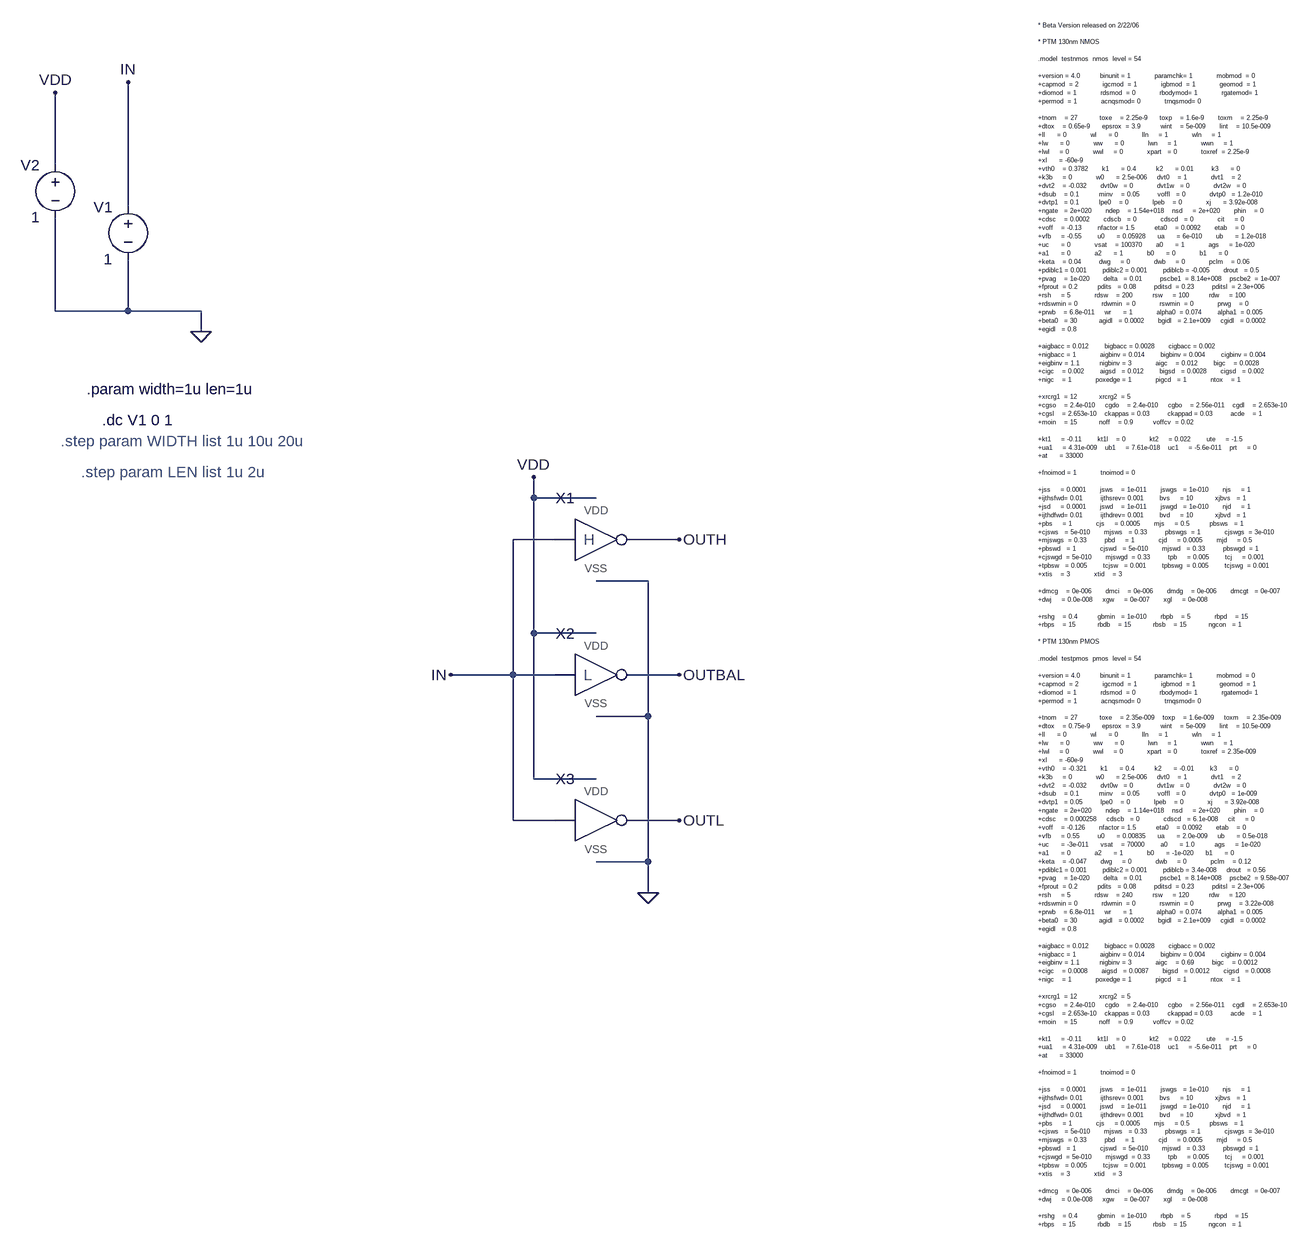
[diagram p0: schematic skewed_inverters.asc]
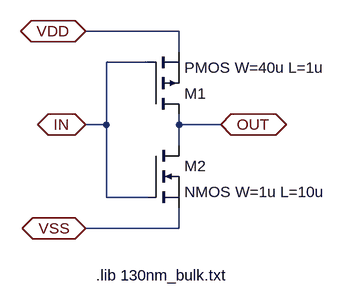
[diagram p1: sub-circuit skewh_inverter.asc]
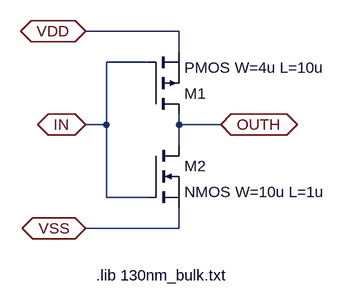
[diagram p2: sub-circuit skewl_inverter.asc]
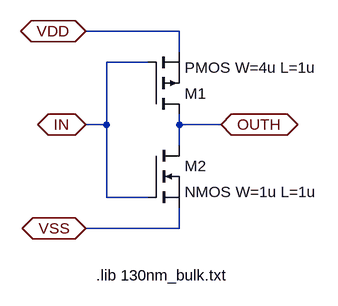
[diagram p3: sub-circuit skewm_inverter.asc]
skewed_inverters.asc, the LTspice schematic file:
Version 4
SHEET 1 1832 3340
WIRE -704 96 -704 -16
WIRE -592 160 -592 -32
WIRE -704 320 -704 176
WIRE -592 320 -592 240
WIRE -592 320 -704 320
WIRE -480 320 -592 320
WIRE -480 352 -480 320
WIRE 32 608 32 576
WIRE 128 608 32 608
WIRE 64 672 0 672
WIRE 256 672 176 672
WIRE 208 736 128 736
WIRE 32 816 32 608
WIRE 128 816 32 816
WIRE 0 880 0 672
WIRE 0 880 -96 880
WIRE 64 880 0 880
WIRE 256 880 176 880
WIRE 208 944 208 736
WIRE 208 944 128 944
WIRE 32 1040 32 816
WIRE 128 1040 32 1040
WIRE 0 1104 0 880
WIRE 64 1104 0 1104
WIRE 256 1104 176 1104
WIRE 208 1168 208 944
WIRE 208 1168 128 1168
WIRE 208 1216 208 1168
FLAG -480 352 0
FLAG -592 -32 IN
FLAG 256 672 OUTH
FLAG -704 -16 VDD
FLAG -96 880 IN
FLAG 256 880 OUTBAL
FLAG 256 1104 OUTL
FLAG 208 1216 0
FLAG 32 576 VDD
SYMBOL voltage -592 144 M0
WINDOW 123 0 0 Left 0
WINDOW 39 0 0 Left 0
SYMATTR InstName V1
SYMATTR Value 1
SYMBOL voltage -704 80 M0
WINDOW 123 0 0 Left 0
WINDOW 39 0 0 Left 0
SYMATTR InstName V2
SYMATTR Value 1
SYMBOL skewH_inverter 128 656 R0
SYMATTR InstName X1
SYMBOL skewL_inverter 128 864 R0
SYMATTR InstName X2
SYMBOL skewM_inverter 128 1088 R0
SYMATTR InstName X3
TEXT 808 -120 Left 0 !* Beta Version released on 2/22/06\n \n* PTM 130nm NMOS \n \n.model  testnmos  nmos  level = 54\n \n+version = 4.0          binunit = 1            paramchk= 1            mobmod  = 0          \n+capmod  = 2            igcmod  = 1            igbmod  = 1            geomod  = 1          \n+diomod  = 1            rdsmod  = 0            rbodymod= 1            rgatemod= 1          \n+permod  = 1            acnqsmod= 0            trnqsmod= 0          \n \n+tnom    = 27           toxe    = 2.25e-9      toxp    = 1.6e-9       toxm    = 2.25e-9   \n+dtox    = 0.65e-9      epsrox  = 3.9          wint    = 5e-009       lint    = 10.5e-009   \n+ll      = 0            wl      = 0            lln     = 1            wln     = 1          \n+lw      = 0            ww      = 0            lwn     = 1            wwn     = 1          \n+lwl     = 0            wwl     = 0            xpart   = 0            toxref  = 2.25e-9   \n+xl      = -60e-9\n+vth0    = 0.3782       k1      = 0.4          k2      = 0.01         k3      = 0          \n+k3b     = 0            w0      = 2.5e-006     dvt0    = 1            dvt1    = 2       \n+dvt2    = -0.032       dvt0w   = 0            dvt1w   = 0            dvt2w   = 0          \n+dsub    = 0.1          minv    = 0.05         voffl   = 0            dvtp0   = 1.2e-010     \n+dvtp1   = 0.1          lpe0    = 0            lpeb    = 0            xj      = 3.92e-008   \n+ngate   = 2e+020       ndep    = 1.54e+018    nsd     = 2e+020       phin    = 0          \n+cdsc    = 0.0002       cdscb   = 0            cdscd   = 0            cit     = 0          \n+voff    = -0.13        nfactor = 1.5          eta0    = 0.0092       etab    = 0          \n+vfb     = -0.55        u0      = 0.05928      ua      = 6e-010       ub      = 1.2e-018     \n+uc      = 0            vsat    = 100370       a0      = 1            ags     = 1e-020     \n+a1      = 0            a2      = 1            b0      = 0            b1      = 0          \n+keta    = 0.04         dwg     = 0            dwb     = 0            pclm    = 0.06       \n+pdiblc1 = 0.001        pdiblc2 = 0.001        pdiblcb = -0.005       drout   = 0.5        \n+pvag    = 1e-020       delta   = 0.01         pscbe1  = 8.14e+008    pscbe2  = 1e-007     \n+fprout  = 0.2          pdits   = 0.08         pditsd  = 0.23         pditsl  = 2.3e+006   \n+rsh     = 5            rdsw    = 200          rsw     = 100          rdw     = 100        \n+rdswmin = 0            rdwmin  = 0            rswmin  = 0            prwg    = 0          \n+prwb    = 6.8e-011     wr      = 1            alpha0  = 0.074        alpha1  = 0.005      \n+beta0   = 30           agidl   = 0.0002       bgidl   = 2.1e+009     cgidl   = 0.0002     \n+egidl   = 0.8          \n \n+aigbacc = 0.012        bigbacc = 0.0028       cigbacc = 0.002     \n+nigbacc = 1            aigbinv = 0.014        bigbinv = 0.004        cigbinv = 0.004      \n+eigbinv = 1.1          nigbinv = 3            aigc    = 0.012        bigc    = 0.0028     \n+cigc    = 0.002        aigsd   = 0.012        bigsd   = 0.0028       cigsd   = 0.002     \n+nigc    = 1            poxedge = 1            pigcd   = 1            ntox    = 1          \n \n+xrcrg1  = 12           xrcrg2  = 5          \n+cgso    = 2.4e-010     cgdo    = 2.4e-010     cgbo    = 2.56e-011    cgdl    = 2.653e-10     \n+cgsl    = 2.653e-10    ckappas = 0.03         ckappad = 0.03         acde    = 1          \n+moin    = 15           noff    = 0.9          voffcv  = 0.02       \n \n+kt1     = -0.11        kt1l    = 0            kt2     = 0.022        ute     = -1.5       \n+ua1     = 4.31e-009    ub1     = 7.61e-018    uc1     = -5.6e-011    prt     = 0          \n+at      = 33000      \n \n+fnoimod = 1            tnoimod = 0          \n \n+jss     = 0.0001       jsws    = 1e-011       jswgs   = 1e-010       njs     = 1          \n+ijthsfwd= 0.01         ijthsrev= 0.001        bvs     = 10           xjbvs   = 1          \n+jsd     = 0.0001       jswd    = 1e-011       jswgd   = 1e-010       njd     = 1          \n+ijthdfwd= 0.01         ijthdrev= 0.001        bvd     = 10           xjbvd   = 1          \n+pbs     = 1            cjs     = 0.0005       mjs     = 0.5          pbsws   = 1          \n+cjsws   = 5e-010       mjsws   = 0.33         pbswgs  = 1            cjswgs  = 3e-010     \n+mjswgs  = 0.33         pbd     = 1            cjd     = 0.0005       mjd     = 0.5        \n+pbswd   = 1            cjswd   = 5e-010       mjswd   = 0.33         pbswgd  = 1          \n+cjswgd  = 5e-010       mjswgd  = 0.33         tpb     = 0.005        tcj     = 0.001      \n+tpbsw   = 0.005        tcjsw   = 0.001        tpbswg  = 0.005        tcjswg  = 0.001      \n+xtis    = 3            xtid    = 3          \n \n+dmcg    = 0e-006       dmci    = 0e-006       dmdg    = 0e-006       dmcgt   = 0e-007     \n+dwj     = 0.0e-008     xgw     = 0e-007       xgl     = 0e-008     \n \n+rshg    = 0.4          gbmin   = 1e-010       rbpb    = 5            rbpd    = 15         \n+rbps    = 15           rbdb    = 15           rbsb    = 15           ngcon   = 1          \n \n* PTM 130nm PMOS\n \n.model  testpmos  pmos  level = 54\n \n+version = 4.0          binunit = 1            paramchk= 1            mobmod  = 0          \n+capmod  = 2            igcmod  = 1            igbmod  = 1            geomod  = 1          \n+diomod  = 1            rdsmod  = 0            rbodymod= 1            rgatemod= 1          \n+permod  = 1            acnqsmod= 0            trnqsmod= 0          \n \n+tnom    = 27           toxe    = 2.35e-009    toxp    = 1.6e-009     toxm    = 2.35e-009   \n+dtox    = 0.75e-9      epsrox  = 3.9          wint    = 5e-009       lint    = 10.5e-009   \n+ll      = 0            wl      = 0            lln     = 1            wln     = 1          \n+lw      = 0            ww      = 0            lwn     = 1            wwn     = 1          \n+lwl     = 0            wwl     = 0            xpart   = 0            toxref  = 2.35e-009   \n+xl      = -60e-9\n+vth0    = -0.321       k1      = 0.4          k2      = -0.01        k3      = 0          \n+k3b     = 0            w0      = 2.5e-006     dvt0    = 1            dvt1    = 2       \n+dvt2    = -0.032       dvt0w   = 0            dvt1w   = 0            dvt2w   = 0          \n+dsub    = 0.1          minv    = 0.05         voffl   = 0            dvtp0   = 1e-009     \n+dvtp1   = 0.05         lpe0    = 0            lpeb    = 0            xj      = 3.92e-008   \n+ngate   = 2e+020       ndep    = 1.14e+018    nsd     = 2e+020       phin    = 0          \n+cdsc    = 0.000258     cdscb   = 0            cdscd   = 6.1e-008     cit     = 0          \n+voff    = -0.126       nfactor = 1.5          eta0    = 0.0092       etab    = 0          \n+vfb     = 0.55         u0      = 0.00835      ua      = 2.0e-009     ub      = 0.5e-018     \n+uc      = -3e-011      vsat    = 70000        a0      = 1.0          ags     = 1e-020     \n+a1      = 0            a2      = 1            b0      = -1e-020      b1      = 0          \n+keta    = -0.047       dwg     = 0            dwb     = 0            pclm    = 0.12       \n+pdiblc1 = 0.001        pdiblc2 = 0.001        pdiblcb = 3.4e-008     drout   = 0.56       \n+pvag    = 1e-020       delta   = 0.01         pscbe1  = 8.14e+008    pscbe2  = 9.58e-007  \n+fprout  = 0.2          pdits   = 0.08         pditsd  = 0.23         pditsl  = 2.3e+006   \n+rsh     = 5            rdsw    = 240          rsw     = 120          rdw     = 120        \n+rdswmin = 0            rdwmin  = 0            rswmin  = 0            prwg    = 3.22e-008  \n+prwb    = 6.8e-011     wr      = 1            alpha0  = 0.074        alpha1  = 0.005      \n+beta0   = 30           agidl   = 0.0002       bgidl   = 2.1e+009     cgidl   = 0.0002     \n+egidl   = 0.8          \n \n+aigbacc = 0.012        bigbacc = 0.0028       cigbacc = 0.002     \n+nigbacc = 1            aigbinv = 0.014        bigbinv = 0.004        cigbinv = 0.004      \n+eigbinv = 1.1          nigbinv = 3            aigc    = 0.69         bigc    = 0.0012     \n+cigc    = 0.0008       aigsd   = 0.0087       bigsd   = 0.0012       cigsd   = 0.0008     \n+nigc    = 1            poxedge = 1            pigcd   = 1            ntox    = 1 \n         \n+xrcrg1  = 12           xrcrg2  = 5          \n+cgso    = 2.4e-010     cgdo    = 2.4e-010     cgbo    = 2.56e-011    cgdl    = 2.653e-10\n+cgsl    = 2.653e-10    ckappas = 0.03         ckappad = 0.03         acde    = 1\n+moin    = 15           noff    = 0.9          voffcv  = 0.02\n \n+kt1     = -0.11        kt1l    = 0            kt2     = 0.022        ute     = -1.5       \n+ua1     = 4.31e-009    ub1     = 7.61e-018    uc1     = -5.6e-011    prt     = 0          \n+at      = 33000      \n \n+fnoimod = 1            tnoimod = 0          \n \n+jss     = 0.0001       jsws    = 1e-011       jswgs   = 1e-010       njs     = 1          \n+ijthsfwd= 0.01         ijthsrev= 0.001        bvs     = 10           xjbvs   = 1          \n+jsd     = 0.0001       jswd    = 1e-011       jswgd   = 1e-010       njd     = 1          \n+ijthdfwd= 0.01         ijthdrev= 0.001        bvd     = 10           xjbvd   = 1          \n+pbs     = 1            cjs     = 0.0005       mjs     = 0.5          pbsws   = 1          \n+cjsws   = 5e-010       mjsws   = 0.33         pbswgs  = 1            cjswgs  = 3e-010     \n+mjswgs  = 0.33         pbd     = 1            cjd     = 0.0005       mjd     = 0.5        \n+pbswd   = 1            cjswd   = 5e-010       mjswd   = 0.33         pbswgd  = 1          \n+cjswgd  = 5e-010       mjswgd  = 0.33         tpb     = 0.005        tcj     = 0.001      \n+tpbsw   = 0.005        tcjsw   = 0.001        tpbswg  = 0.005        tcjswg  = 0.001      \n+xtis    = 3            xtid    = 3          \n \n+dmcg    = 0e-006       dmci    = 0e-006       dmdg    = 0e-006       dmcgt   = 0e-007     \n+dwj     = 0.0e-008     xgw     = 0e-007       xgl     = 0e-008     \n \n+rshg    = 0.4          gbmin   = 1e-010       rbpb    = 5            rbpd    = 15         \n+rbps    = 15           rbdb    = 15           rbsb    = 15           ngcon   = 1
TEXT -632 488 Left 2 !.dc V1 0 1
TEXT -656 440 Left 2 !.param width=1u len=1u
TEXT -696 520 Left 2 ;.step param WIDTH list 1u 10u 20u
TEXT -664 568 Left 2 ;.step param LEN list 1u 2u

skewh_inverter.asc, the sub-circuit schematic file:
Version 4
SHEET 1 880 680
WIRE 128 -48 -16 -48
WIRE 128 -16 128 -48
WIRE 80 0 16 0
WIRE 16 96 16 0
WIRE 16 96 -16 96
WIRE 128 96 128 80
WIRE 192 96 128 96
WIRE 128 128 128 96
WIRE 16 208 16 96
WIRE 80 208 16 208
WIRE 128 256 128 224
WIRE 128 256 -16 256
FLAG 192 96 OUT
IOPIN 192 96 BiDir
FLAG -16 -48 VDD
IOPIN -16 -48 BiDir
FLAG -16 96 IN
IOPIN -16 96 BiDir
FLAG -16 256 VSS
IOPIN -16 256 BiDir
SYMBOL pmos 80 80 M180
SYMATTR InstName M1
SYMATTR Value PMOS W=40u L=1u
SYMBOL nmos 80 128 R0
SYMATTR InstName M2
SYMATTR Value NMOS W=1u L=10u
TEXT 0 328 Left 2 !.lib 130nm_bulk.txt

skewl_inverter.asc, the sub-circuit schematic file:
Version 4
SHEET 1 880 980
WIRE 320 -128 176 -128
WIRE 320 -96 320 -128
WIRE 272 -80 208 -80
WIRE 208 16 208 -80
WIRE 208 16 176 16
WIRE 320 16 320 0
WIRE 384 16 320 16
WIRE 320 48 320 16
WIRE 208 128 208 16
WIRE 272 128 208 128
WIRE 320 176 320 144
WIRE 320 176 176 176
FLAG 384 16 OUTH
IOPIN 384 16 BiDir
FLAG 176 -128 VDD
IOPIN 176 -128 BiDir
FLAG 176 16 IN
IOPIN 176 16 BiDir
FLAG 176 176 VSS
IOPIN 176 176 BiDir
SYMBOL pmos 272 0 M180
SYMATTR InstName M1
SYMATTR Value PMOS W=4u L=10u
SYMBOL nmos 272 48 R0
SYMATTR InstName M2
SYMATTR Value NMOS W=10u L=1u
TEXT 192 248 Left 2 !.lib 130nm_bulk.txt

skewm_inverter.asc, the sub-circuit schematic file:
Version 4
SHEET 1 880 980
WIRE 320 -128 176 -128
WIRE 320 -96 320 -128
WIRE 272 -80 208 -80
WIRE 208 16 208 -80
WIRE 208 16 176 16
WIRE 320 16 320 0
WIRE 384 16 320 16
WIRE 320 48 320 16
WIRE 208 128 208 16
WIRE 272 128 208 128
WIRE 320 176 320 144
WIRE 320 176 176 176
FLAG 384 16 OUTH
IOPIN 384 16 BiDir
FLAG 176 -128 VDD
IOPIN 176 -128 BiDir
FLAG 176 16 IN
IOPIN 176 16 BiDir
FLAG 176 176 VSS
IOPIN 176 176 BiDir
SYMBOL pmos 272 0 M180
SYMATTR InstName M1
SYMATTR Value PMOS W=4u L=1u
SYMBOL nmos 272 48 R0
SYMATTR InstName M2
SYMATTR Value NMOS W=1u L=1u
TEXT 192 248 Left 2 !.lib 130nm_bulk.txt

The netlist it stands for:
* skewed_inverters.asc
V1 IN 0 1
V2 VDD 0 1
XX1 IN OUTH VDD 0 skewh_inverter
XX2 IN OUTBAL VDD 0 skewl_inverter
XX3 IN OUTL VDD 0 skewm_inverter

* block symbol definitions
.subckt skewh_inverter IN OUT VDD VSS
M1 OUT IN VDD VDD PMOS W=40u L=1u
M2 OUT IN VSS VSS NMOS W=1u L=10u
.lib 130nm_bulk.txt
.ends skewh_inverter

.subckt skewl_inverter IN OUTH VDD VSS
M1 OUTH IN VDD VDD PMOS W=4u L=10u
M2 OUTH IN VSS VSS NMOS W=10u L=1u
.lib 130nm_bulk.txt
.ends skewl_inverter

.subckt skewm_inverter IN OUTH VDD VSS
M1 OUTH IN VDD VDD PMOS W=4u L=1u
M2 OUTH IN VSS VSS NMOS W=1u L=1u
.lib 130nm_bulk.txt
.ends skewm_inverter

.model NMOS NMOS
.model PMOS PMOS
.lib standard.mos
* Beta Version released on 2/22/06
* PTM 130nm NMOS
.model  testnmos  nmos  level = 54
+version = 4.0          binunit = 1            paramchk= 1            mobmod  = 0
+capmod  = 2            igcmod  = 1            igbmod  = 1            geomod  = 1
+diomod  = 1            rdsmod  = 0            rbodymod= 1            rgatemod= 1
+permod  = 1            acnqsmod= 0            trnqsmod= 0
+tnom    = 27           toxe    = 2.25e-9      toxp    = 1.6e-9       toxm    = 2.25e-9
+dtox    = 0.65e-9      epsrox  = 3.9          wint    = 5e-009       lint    = 10.5e-009
+ll      = 0            wl      = 0            lln     = 1            wln     = 1
+lw      = 0            ww      = 0            lwn     = 1            wwn     = 1
+lwl     = 0            wwl     = 0            xpart   = 0            toxref  = 2.25e-9
+xl      = -60e-9
+vth0    = 0.3782       k1      = 0.4          k2      = 0.01         k3      = 0
+k3b     = 0            w0      = 2.5e-006     dvt0    = 1            dvt1    = 2
+dvt2    = -0.032       dvt0w   = 0            dvt1w   = 0            dvt2w   = 0
+dsub    = 0.1          minv    = 0.05         voffl   = 0            dvtp0   = 1.2e-010
+dvtp1   = 0.1          lpe0    = 0            lpeb    = 0            xj      = 3.92e-008
+ngate   = 2e+020       ndep    = 1.54e+018    nsd     = 2e+020       phin    = 0
+cdsc    = 0.0002       cdscb   = 0            cdscd   = 0            cit     = 0
+voff    = -0.13        nfactor = 1.5          eta0    = 0.0092       etab    = 0
+vfb     = -0.55        u0      = 0.05928      ua      = 6e-010       ub      = 1.2e-018
+uc      = 0            vsat    = 100370       a0      = 1            ags     = 1e-020
+a1      = 0            a2      = 1            b0      = 0            b1      = 0
+keta    = 0.04         dwg     = 0            dwb     = 0            pclm    = 0.06
+pdiblc1 = 0.001        pdiblc2 = 0.001        pdiblcb = -0.005       drout   = 0.5
+pvag    = 1e-020       delta   = 0.01         pscbe1  = 8.14e+008    pscbe2  = 1e-007
+fprout  = 0.2          pdits   = 0.08         pditsd  = 0.23         pditsl  = 2.3e+006
+rsh     = 5            rdsw    = 200          rsw     = 100          rdw     = 100
+rdswmin = 0            rdwmin  = 0            rswmin  = 0            prwg    = 0
+prwb    = 6.8e-011     wr      = 1            alpha0  = 0.074        alpha1  = 0.005
+beta0   = 30           agidl   = 0.0002       bgidl   = 2.1e+009     cgidl   = 0.0002
+egidl   = 0.8
+aigbacc = 0.012        bigbacc = 0.0028       cigbacc = 0.002
+nigbacc = 1            aigbinv = 0.014        bigbinv = 0.004        cigbinv = 0.004
+eigbinv = 1.1          nigbinv = 3            aigc    = 0.012        bigc    = 0.0028
+cigc    = 0.002        aigsd   = 0.012        bigsd   = 0.0028       cigsd   = 0.002
+nigc    = 1            poxedge = 1            pigcd   = 1            ntox    = 1
+xrcrg1  = 12           xrcrg2  = 5
+cgso    = 2.4e-010     cgdo    = 2.4e-010     cgbo    = 2.56e-011    cgdl    = 2.653e-10
+cgsl    = 2.653e-10    ckappas = 0.03         ckappad = 0.03         acde    = 1
+moin    = 15           noff    = 0.9          voffcv  = 0.02
+kt1     = -0.11        kt1l    = 0            kt2     = 0.022        ute     = -1.5
+ua1     = 4.31e-009    ub1     = 7.61e-018    uc1     = -5.6e-011    prt     = 0
+at      = 33000
+fnoimod = 1            tnoimod = 0
+jss     = 0.0001       jsws    = 1e-011       jswgs   = 1e-010       njs     = 1
+ijthsfwd= 0.01         ijthsrev= 0.001        bvs     = 10           xjbvs   = 1
+jsd     = 0.0001       jswd    = 1e-011       jswgd   = 1e-010       njd     = 1
+ijthdfwd= 0.01         ijthdrev= 0.001        bvd     = 10           xjbvd   = 1
+pbs     = 1            cjs     = 0.0005       mjs     = 0.5          pbsws   = 1
+cjsws   = 5e-010       mjsws   = 0.33         pbswgs  = 1            cjswgs  = 3e-010
+mjswgs  = 0.33         pbd     = 1            cjd     = 0.0005       mjd     = 0.5
+pbswd   = 1            cjswd   = 5e-010       mjswd   = 0.33         pbswgd  = 1
+cjswgd  = 5e-010       mjswgd  = 0.33         tpb     = 0.005        tcj     = 0.001
+tpbsw   = 0.005        tcjsw   = 0.001        tpbswg  = 0.005        tcjswg  = 0.001
+xtis    = 3            xtid    = 3
+dmcg    = 0e-006       dmci    = 0e-006       dmdg    = 0e-006       dmcgt   = 0e-007
+dwj     = 0.0e-008     xgw     = 0e-007       xgl     = 0e-008
+rshg    = 0.4          gbmin   = 1e-010       rbpb    = 5            rbpd    = 15
+rbps    = 15           rbdb    = 15           rbsb    = 15           ngcon   = 1
* PTM 130nm PMOS
.model  testpmos  pmos  level = 54
+version = 4.0          binunit = 1            paramchk= 1            mobmod  = 0
+capmod  = 2            igcmod  = 1            igbmod  = 1            geomod  = 1
+diomod  = 1            rdsmod  = 0            rbodymod= 1            rgatemod= 1
+permod  = 1            acnqsmod= 0            trnqsmod= 0
+tnom    = 27           toxe    = 2.35e-009    toxp    = 1.6e-009     toxm    = 2.35e-009
+dtox    = 0.75e-9      epsrox  = 3.9          wint    = 5e-009       lint    = 10.5e-009
+ll      = 0            wl      = 0            lln     = 1            wln     = 1
+lw      = 0            ww      = 0            lwn     = 1            wwn     = 1
+lwl     = 0            wwl     = 0            xpart   = 0            toxref  = 2.35e-009
+xl      = -60e-9
+vth0    = -0.321       k1      = 0.4          k2      = -0.01        k3      = 0
+k3b     = 0            w0      = 2.5e-006     dvt0    = 1            dvt1    = 2
+dvt2    = -0.032       dvt0w   = 0            dvt1w   = 0            dvt2w   = 0
+dsub    = 0.1          minv    = 0.05         voffl   = 0            dvtp0   = 1e-009
+dvtp1   = 0.05         lpe0    = 0            lpeb    = 0            xj      = 3.92e-008
+ngate   = 2e+020       ndep    = 1.14e+018    nsd     = 2e+020       phin    = 0
+cdsc    = 0.000258     cdscb   = 0            cdscd   = 6.1e-008     cit     = 0
+voff    = -0.126       nfactor = 1.5          eta0    = 0.0092       etab    = 0
+vfb     = 0.55         u0      = 0.00835      ua      = 2.0e-009     ub      = 0.5e-018
+uc      = -3e-011      vsat    = 70000        a0      = 1.0          ags     = 1e-020
+a1      = 0            a2      = 1            b0      = -1e-020      b1      = 0
+keta    = -0.047       dwg     = 0            dwb     = 0            pclm    = 0.12
+pdiblc1 = 0.001        pdiblc2 = 0.001        pdiblcb = 3.4e-008     drout   = 0.56
+pvag    = 1e-020       delta   = 0.01         pscbe1  = 8.14e+008    pscbe2  = 9.58e-007
+fprout  = 0.2          pdits   = 0.08         pditsd  = 0.23         pditsl  = 2.3e+006
+rsh     = 5            rdsw    = 240          rsw     = 120          rdw     = 120
+rdswmin = 0            rdwmin  = 0            rswmin  = 0            prwg    = 3.22e-008
+prwb    = 6.8e-011     wr      = 1            alpha0  = 0.074        alpha1  = 0.005
+beta0   = 30           agidl   = 0.0002       bgidl   = 2.1e+009     cgidl   = 0.0002
+egidl   = 0.8
+aigbacc = 0.012        bigbacc = 0.0028       cigbacc = 0.002
+nigbacc = 1            aigbinv = 0.014        bigbinv = 0.004        cigbinv = 0.004
+eigbinv = 1.1          nigbinv = 3            aigc    = 0.69         bigc    = 0.0012
+cigc    = 0.0008       aigsd   = 0.0087       bigsd   = 0.0012       cigsd   = 0.0008
+nigc    = 1            poxedge = 1            pigcd   = 1            ntox    = 1
+xrcrg1  = 12           xrcrg2  = 5
+cgso    = 2.4e-010     cgdo    = 2.4e-010     cgbo    = 2.56e-011    cgdl    = 2.653e-10
+cgsl    = 2.653e-10    ckappas = 0.03         ckappad = 0.03         acde    = 1
+moin    = 15           noff    = 0.9          voffcv  = 0.02
+kt1     = -0.11        kt1l    = 0            kt2     = 0.022        ute     = -1.5
+ua1     = 4.31e-009    ub1     = 7.61e-018    uc1     = -5.6e-011    prt     = 0
+at      = 33000
+fnoimod = 1            tnoimod = 0
+jss     = 0.0001       jsws    = 1e-011       jswgs   = 1e-010       njs     = 1
+ijthsfwd= 0.01         ijthsrev= 0.001        bvs     = 10           xjbvs   = 1
+jsd     = 0.0001       jswd    = 1e-011       jswgd   = 1e-010       njd     = 1
+ijthdfwd= 0.01         ijthdrev= 0.001        bvd     = 10           xjbvd   = 1
+pbs     = 1            cjs     = 0.0005       mjs     = 0.5          pbsws   = 1
+cjsws   = 5e-010       mjsws   = 0.33         pbswgs  = 1            cjswgs  = 3e-010
+mjswgs  = 0.33         pbd     = 1            cjd     = 0.0005       mjd     = 0.5
+pbswd   = 1            cjswd   = 5e-010       mjswd   = 0.33         pbswgd  = 1
+cjswgd  = 5e-010       mjswgd  = 0.33         tpb     = 0.005        tcj     = 0.001
+tpbsw   = 0.005        tcjsw   = 0.001        tpbswg  = 0.005        tcjswg  = 0.001
+xtis    = 3            xtid    = 3
+dmcg    = 0e-006       dmci    = 0e-006       dmdg    = 0e-006       dmcgt   = 0e-007
+dwj     = 0.0e-008     xgw     = 0e-007       xgl     = 0e-008
+rshg    = 0.4          gbmin   = 1e-010       rbpb    = 5            rbpd    = 15
+rbps    = 15           rbdb    = 15           rbsb    = 15           ngcon   = 1
.dc V1 0 1
.param width=1u len=1u
* .step param WIDTH list 1u 10u 20u
* .step param LEN list 1u 2u
.backanno
.end

* Results of the author's LTspice run, read from the files saved beside the schematic
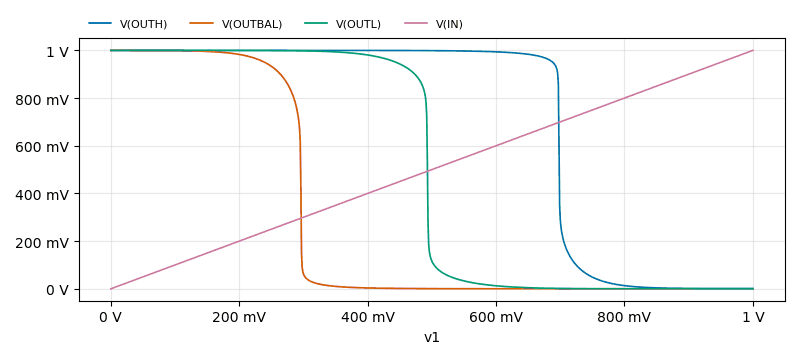
[diagram p4: DC transfer characteristic of skewed_inverters.asc, plotted from the saved traces]
* DC transfer characteristic, 1 run:
*   V(OUTH): 1 V at v1=0 V, 1.443 mV at v1=1 V, min 1.233 mV, max 1 V
*   V(OUTBAL): 999.8 mV at v1=0 V, 13.38 µV at v1=1 V, min 5.088 µV, max 999.8 mV
*   V(OUTL): 1 V at v1=0 V, 13.82 µV at v1=1 V, min 11.82 µV, max 1 V
*   V(IN): 0 V at v1=0 V, 1 V at v1=1 V, min 0 V, max 1 V